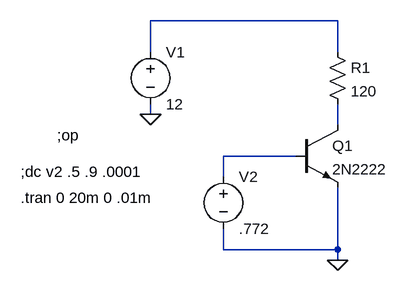
[diagram p0: schematic claseateoria1.asc]
claseateoria1.asc, the LTspice schematic file:
Version 4
SHEET 1 880 680
WIRE 272 -32 -16 -32
WIRE -16 16 -16 -32
WIRE 272 16 272 -32
WIRE -16 112 -16 96
WIRE 272 128 272 96
WIRE 208 176 96 176
WIRE 96 208 96 176
WIRE 96 320 96 288
WIRE 272 320 272 224
WIRE 272 320 96 320
WIRE 272 336 272 320
FLAG 272 336 0
FLAG -16 112 0
SYMBOL npn 208 128 R0
SYMATTR InstName Q1
SYMATTR Value 2N2222
SYMBOL res 256 0 R0
SYMATTR InstName R1
SYMATTR Value 120
SYMBOL voltage -16 0 R0
WINDOW 123 0 0 Left 0
WINDOW 39 0 0 Left 0
SYMATTR InstName V1
SYMATTR Value 12
SYMBOL voltage 96 192 R0
WINDOW 123 0 0 Left 0
WINDOW 39 0 0 Left 0
SYMATTR InstName V2
SYMATTR Value .772
TEXT -160 144 Left 2 !;op
TEXT -216 200 Left 2 !;dc v2 .5 .9 .0001
TEXT -216 240 Left 2 !.tran 0 20m 0 .01m

The netlist it stands for:
* claseateoria1.asc
Q1 N002 N003 0 0 2N2222
R1 N001 N002 120
V1 N001 0 12
V2 N003 0 .772
.model NPN NPN
.model PNP PNP
.lib standard.bjt
;op
;dc v2 .5 .9 .0001
.tran 0 20m 0 .01m
.backanno
.end